# EAGLE design wpm1 (EAGLE 5.10)
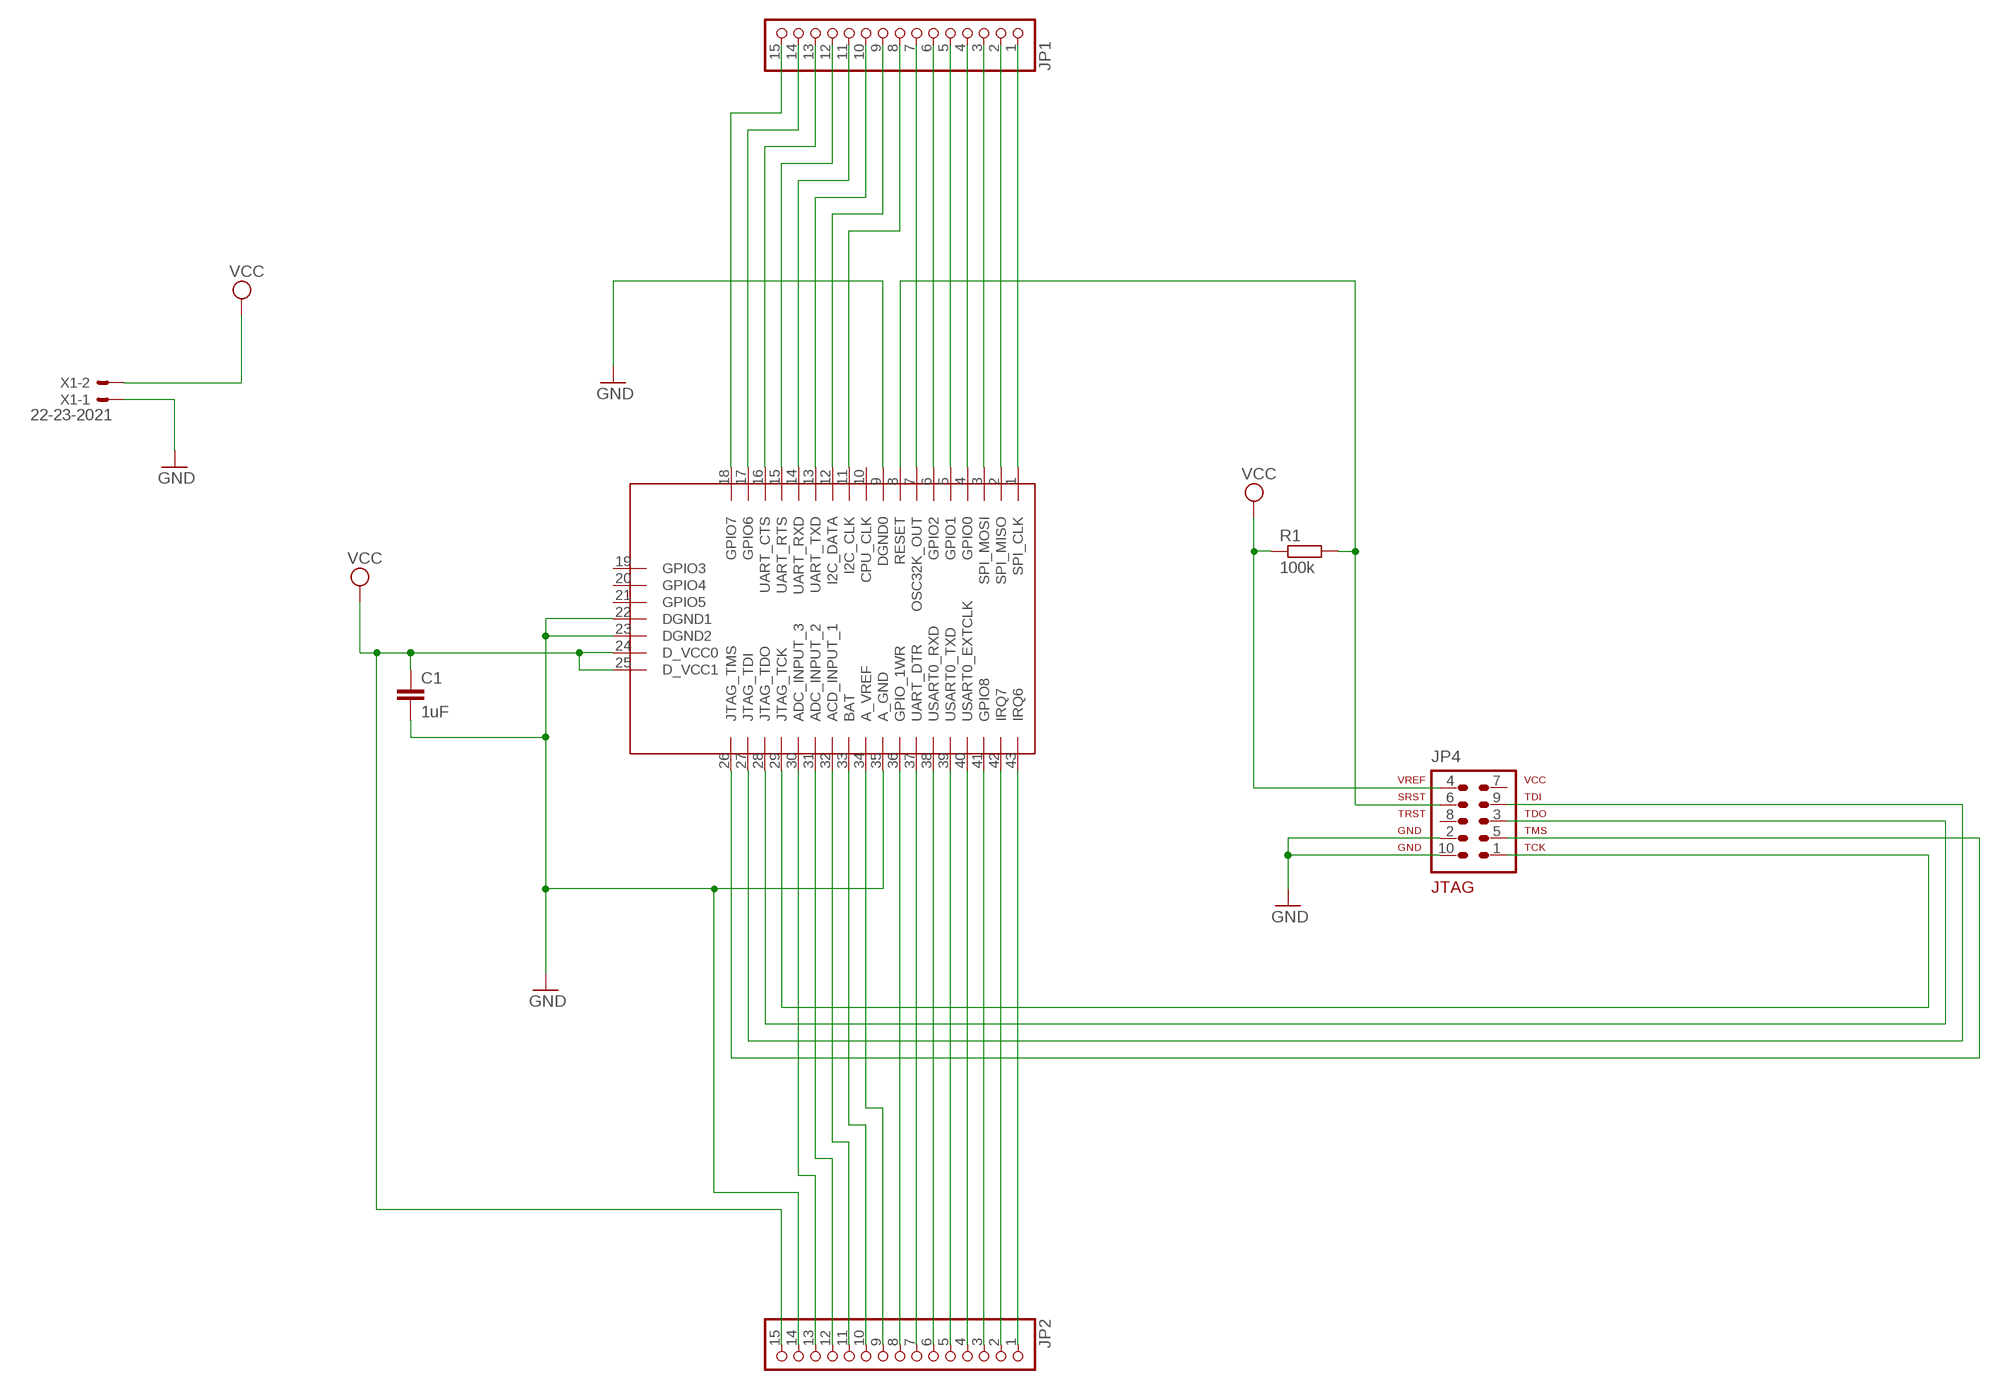
[diagram p0: schematic, sheet 1]

## Parts
C1  1uF  C-EUC1206  [C1206]
JP1  PINHD-1X15  [1X15]
JP2  PINHD-1X15  [1X15]
JP4  AVR-JTAG-10  [AVR-JTAG-10]
R1  100k  R-EU_R1206  [R1206]
U$2  ATZB-24  [ATZB-24-A2]
X1  22-23-2021  [22-23-2021]

## Nets
GND: C1.2 JP2.14 JP4.2 JP4.10 U$2.9(DGND0) U$2.22(DGND1) U$2.23(DGND2) U$2.35(A_GND) X1.1
N$1: JP4.1 U$2.29(JTAG_TCK)
N$2: JP4.3 U$2.28(JTAG_TDO)
N$3: JP4.9 U$2.27(JTAG_TDI)
N$4: JP4.5 U$2.26(JTAG_TMS)
N$5: JP2.1 U$2.43(IRQ6)
N$6: JP4.6 R1.2 U$2.8(RESET)
N$7: JP2.2 U$2.42(IRQ7)
N$8: JP2.3 U$2.41(GPIO8)
N$9: JP2.4 U$2.40(USART0_EXTCLK)
N$10: JP2.5 U$2.39(USART0_TXD)
N$11: JP2.6 U$2.38(USART0_RXD)
N$12: JP2.7 U$2.37(UART_DTR)
N$13: JP2.8 U$2.36(GPIO_1WR)
N$14: JP2.9 U$2.34(A_VREF)
N$15: JP2.10 U$2.33(BAT)
N$16: JP2.11 U$2.32(ACD_INPUT_1)
N$17: JP2.12 U$2.31(ADC_INPUT_2)
N$18: JP2.13 U$2.30(ADC_INPUT_3)
N$19: JP1.1 U$2.1(SPI_CLK)
N$20: JP1.2 U$2.2(SPI_MISO)
N$21: JP1.3 U$2.3(SPI_MOSI)
N$22: JP1.4 U$2.4(GPIO0)
N$23: JP1.5 U$2.5(GPIO1)
N$24: JP1.6 U$2.6(GPIO2)
N$25: JP1.7 U$2.7(OSC32K_OUT)
N$26: JP1.8 U$2.11(I2C_CLK)
N$27: JP1.9 U$2.12(I2C_DATA)
N$28: JP1.10 U$2.13(UART_TXD)
N$29: JP1.11 U$2.14(UART_RXD)
N$30: JP1.12 U$2.15(UART_RTS)
N$31: JP1.13 U$2.16(UART_CTS)
N$33: JP1.14 U$2.17(GPIO6)
N$34: JP1.15 U$2.18(GPIO7)
VCC: C1.1 JP2.15 JP4.4 R1.1 U$2.24(D_VCC0) U$2.25(D_VCC1) X1.2
Unconnected: JP4.7 JP4.8 U$2.10(CPU_CLK) U$2.19(GPIO3) U$2.20(GPIO4) U$2.21(GPIO5)

## Library data of the parts
C1 = rcl:C-EU: CAPACITOR, European symbol
JP1 JP2 = pinhead:PINHD-1X15: PIN HEADER
JP4 = atmel-isp:AVR-JTAG-10: AVR JTAG Debug/Programming Header
R1 = rcl:R-EU_: RESISTOR, European symbol
U$2 = Atmel-zigbit:ATZB-24
X1 = con-molex:22-23-2021: .100" (2.54mm) Center Header - 2 Pin

## Board
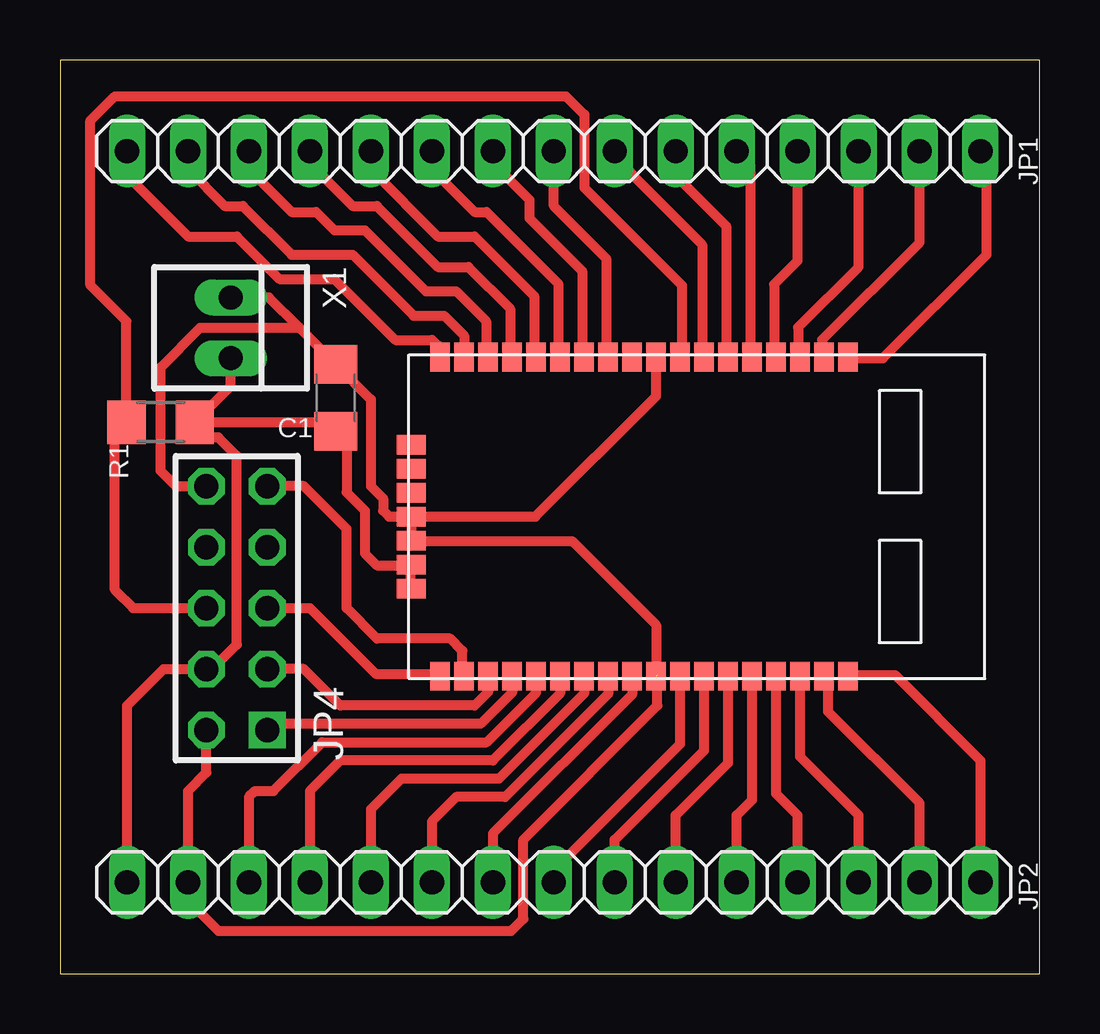
[diagram p1: board, top side]

Size 40.82 x 38.09 mm. Coordinates in mm from the lower left corner, seen from the top.
Outline: 0,0 40.82,0 40.82,38.09 0,38.09 0,0
Copper layers (1*16): Top 0.035mm / dielectric 1.5mm / Bottom 0.035mm
Design rules "default *": minimum track width 6mil, minimum drill 12mil, track to track 6mil, track to pad 6mil, pad to pad 6mil, via to via 6mil, smd to smd 6mil, copper to edge 40mil, drill to drill 8mil, minimum pad ring 10mil, minimum via ring 8mil, stop-mask expansion 4mil, vias tented up to drill 0mil, thermal gap 10mil

### Footprints (pad centres in the part's own frame; a part is rotated, then mirrored left to right if it is on the bottom)
C1206 = smd 1.6 x 1.8: 1 -1.4,0; 2 1.4,0
1X15 = drill 1.016 long: 1 -17.78,0; 2 -15.24,0; 3 -12.7,0; 4 -10.16,0; 5 -7.62,0; 6 -5.08,0; 7 -2.54,0; 8 0,0; 9 2.54,0; 10 5.08,0; 11 7.62,0; 12 10.16,0; 13 12.7,0; 14 15.24,0; 15 17.78,0
AVR-JTAG-10 = drill 1.016 square: 1 -5.08,-1.27 | drill 1.016 octagon: 2 -5.08,1.27; 3 -2.54,-1.27; 4 -2.54,1.27; 5 0,-1.27; 6 0,1.27; 7 2.54,-1.27; 8 2.54,1.27; 9 5.08,-1.27; 10 5.08,1.27
R1206 = smd 1.6 x 1.803: 1 -1.422,0; 2 1.422,0
ATZB-24-A2 = smd 0.8 x 1.2: 1 8.45,6.65; 2 7.45,6.65; 3 6.45,6.65; 4 5.45,6.65; 5 4.45,6.65; 6 3.45,6.65; 7 2.45,6.65; 8 1.45,6.65; 9 0.45,6.65; 10 -0.55,6.65; 11 -1.55,6.65; 12 -2.55,6.65; 13 -3.55,6.65; 14 -4.55,6.65; 15 -5.55,6.65; 16 -6.55,6.65; 17 -7.55,6.65; 18 -8.55,6.65; 26 -8.55,-6.65; 27 -7.55,-6.65; 28 -6.55,-6.65; 29 -5.55,-6.65; 30 -4.55,-6.65; 31 -3.55,-6.65; 32 -2.55,-6.65; 33 -1.55,-6.65; 34 -0.55,-6.65; 35 0.45,-6.65; 36 1.45,-6.65; 37 2.45,-6.65; 38 3.45,-6.65; 39 4.45,-6.65; 40 5.45,-6.65; 41 6.45,-6.65; 42 7.45,-6.65; 43 8.45,-6.65 | smd 1.2 x 0.8: 19 -9.75,3; 20 -9.75,2; 21 -9.75,1; 22 -9.75,0; 23 -9.75,-1; 24 -9.75,-2; 25 -9.75,-3
22-23-2021 = drill 1 long: 1 -1.27,0; 2 1.27,0

### Placement (x,y rotation side)
C1  11.49,24 90 top
JP1  20.57,34.29 180 top
JP2  20.57,3.81 180 top
JP4  7.37,15.24 90 top
R1  4.19,22.99 180 top
U$2  24.38,19.05 0 top
X1  7.11,26.92 270 top

### Tracks (layer width: path | path; a pad name or v marks a point on that pad's centre or on a via)
GND  (1 unrouted)
  Top 0.406: 9.97,26.92 C1.2 12.95,23.94 12.95,20.32 13.46,19.81 13.46,19.3 13.72,19.05 U$2.22 | 9.97,26.92 5.84,26.92 4.19,25.27 4.19,20.95 4.83,20.32 JP4.10 | U$2.22 U$2.23 14.65,18.03 21.34,18.03 24.83,14.54 U$2.35 | U$2.9 24.83,24.07 19.81,19.05 U$2.22 | X1.1 8.7,28.19 9.97,26.92 | JP4.2 6.1,8.38 5.33,7.62 JP2.14 5.33,3.05 6.6,1.78 18.8,1.78 19.3,2.29 19.3,5.59 24.89,11.18 24.89,12.45
N$1
  Top 0.406: U$2.29 18.83,11.72 17.53,10.41 8.89,10.41 JP4.1
N$2
  Top 0.406: U$2.28 17.83,11.74 17.27,11.18 11.68,11.18 10.16,12.7 JP4.3
N$3
  Top 0.406: U$2.27 16.76,12.47 16.76,13.46 16.26,13.97 13.21,13.97 11.94,15.24 11.94,18.54 10.16,20.32 JP4.9
N$4
  Top 0.406: U$2.26 15.73,12.5 13.15,12.5 10.41,15.24 JP4.5
N$5
  Top 0.406: JP2.1 38.35,8.89 34.8,12.45 32.88,12.45 U$2.43
N$6
  Top 0.406: R1.2 2.16,22.38 | R1.2 2.77,27.2 1.27,28.7 1.27,35.56 2.29,36.58 21.08,36.58 21.84,35.81 21.84,32.77 25.91,28.7 25.91,25.77 U$2.8 25.65,25.88 | JP4.6 3.05,15.24 2.29,16 2.29,22.5 R1.2
N$7
  Top 0.406: JP2.2 35.81,7.11 32,10.92 32,12.23 U$2.42
N$8
  Top 0.406: JP2.3 33.27,6.6 30.83,9.04 U$2.41
N$9
  Top 0.406: JP2.4 30.73,6.6 29.83,7.5 U$2.40
N$10
  Top 0.406: JP2.5 28.19,6.6 28.66,7.07 28.83,7.24 U$2.39
N$11
  Top 0.406: JP2.6 25.65,6.6 27.83,8.78 U$2.38
N$12
  Top 0.406: JP2.7 23.11,5.59 26.83,9.31 U$2.37
N$13
  Top 0.406: JP2.8 20.57,4.32 25.83,9.58 U$2.36
N$14
  Top 0.406: U$2.34 23.83,11.64 18.03,5.84 JP2.9
N$15
  Top 0.406: U$2.33 22.83,11.66 18.54,7.37 16.51,7.37 15.49,6.35 JP2.10
N$16
  Top 0.406: U$2.32 21.83,11.67 18.29,8.13 14.22,8.13 12.95,6.86 JP2.11
N$17
  Top 0.406: U$2.31 20.83,11.69 18.03,8.89 11.68,8.89 10.41,7.62 JP2.12
N$18
  Top 0.406: U$2.30 19.83,11.71 17.78,9.65 10.92,9.65 8.89,7.62 8.13,7.62 7.87,7.37 JP2.13
N$19
  Top 0.406: JP1.1 38.61,34.04 38.61,29.97 34.29,25.65 32.88,25.65 U$2.1
N$20
  Top 0.406: JP1.2 35.81,30.48 31.76,26.43 31.76,25.77 U$2.2
N$21
  Top 0.406: JP1.3 33.27,29.46 30.76,26.95 30.76,25.77 U$2.3
N$22
  Top 0.406: JP1.4 30.73,29.72 29.76,28.74 29.76,25.77 U$2.4
N$23
  Top 0.406: JP1.5 28.76,33.73 28.76,25.77 U$2.5
N$24
  Top 0.406: JP1.6 25.65,33.27 27.76,31.17 27.76,25.77 U$2.6
N$25
  Top 0.406: JP1.7 23.88,33.27 26.76,30.39 26.76,25.77 U$2.7
N$26
  Top 0.406: JP1.8 20.57,32 22.76,29.82 22.76,25.77 U$2.11
N$27
  Top 0.406: JP1.9 18.03,33.78 19.56,32.26 19.56,31.5 21.76,29.3 21.76,25.77 U$2.12
N$28
  Top 0.406: JP1.10 15.49,33.53 17.27,31.75 17.78,31.75 20.76,28.77 20.76,25.77 U$2.13
N$29
  Top 0.406: JP1.11 12.95,33.53 15.75,30.73 17.27,30.73 19.76,28.25 19.76,25.77 U$2.14
N$30
  Top 0.406: JP1.12 10.41,33.78 12.19,32 13.21,32 15.75,29.46 17.02,29.46 18.76,27.72 18.76,25.77 U$2.15
N$31
  Top 0.406: JP1.13 7.87,33.53 9.65,31.75 10.67,31.75 11.43,30.99 12.7,30.99 15.24,28.45 16.51,28.45 17.76,27.2 17.76,25.77 U$2.16
N$33
  Top 0.406: JP1.14 5.33,33.53 6.86,32 7.62,32 9.65,29.97 12.19,29.97 14.73,27.43 16,27.43 16.83,26.6 U$2.17
N$34
  Top 0.406: JP1.15 3.05,34.04 3.05,33.02 5.33,30.73 7.37,30.73 9.14,28.96 11.43,28.96 13.97,26.42 15.49,26.42 15.83,26.08 U$2.18
VCC
  Top 0.406: 14.6,17.02 13.21,17.02 12.7,17.53 12.7,19.3 11.94,20.07 11.94,22.16 C1.1 11.11,22.99 R1.1 | 14.6,17.02 U$2.24 | 14.6,17.02 14.6,16.08 U$2.25 | X1.2 7.11,24.49 R1.1 | JP2.15 2.79,11.18 4.32,12.7 JP4.4 6.35,12.7 7.37,13.72 7.37,21.59 6.6,22.35 6.25,22.35 R1.1